# Altium schematic sheet DDS_OUT_channel.SchDoc: Output stage: Attenuator,
size 420 x 297 mm; Author: G.K.; CompanyName: WUT; DrawnBy: G.K.; Organization: WUT ISE; Address1: Warsaw Univeristy of Technology; Address2: Nowowiejska 15/19; DocumentNumber: 4; SheetNumber: 4; SheetTotal: 7; EDA_Number: ARTIQ; Projet: ARTIQ/SINARA; ModifiedBy: -; CreateDate: XX/XX/XXXX; CheckedDate: -; Title2: amplifier and filter; DivGrp: ISE; Designer: G.K.; ModifiedDate: -; ProjectName: ARTIQ/SINARA
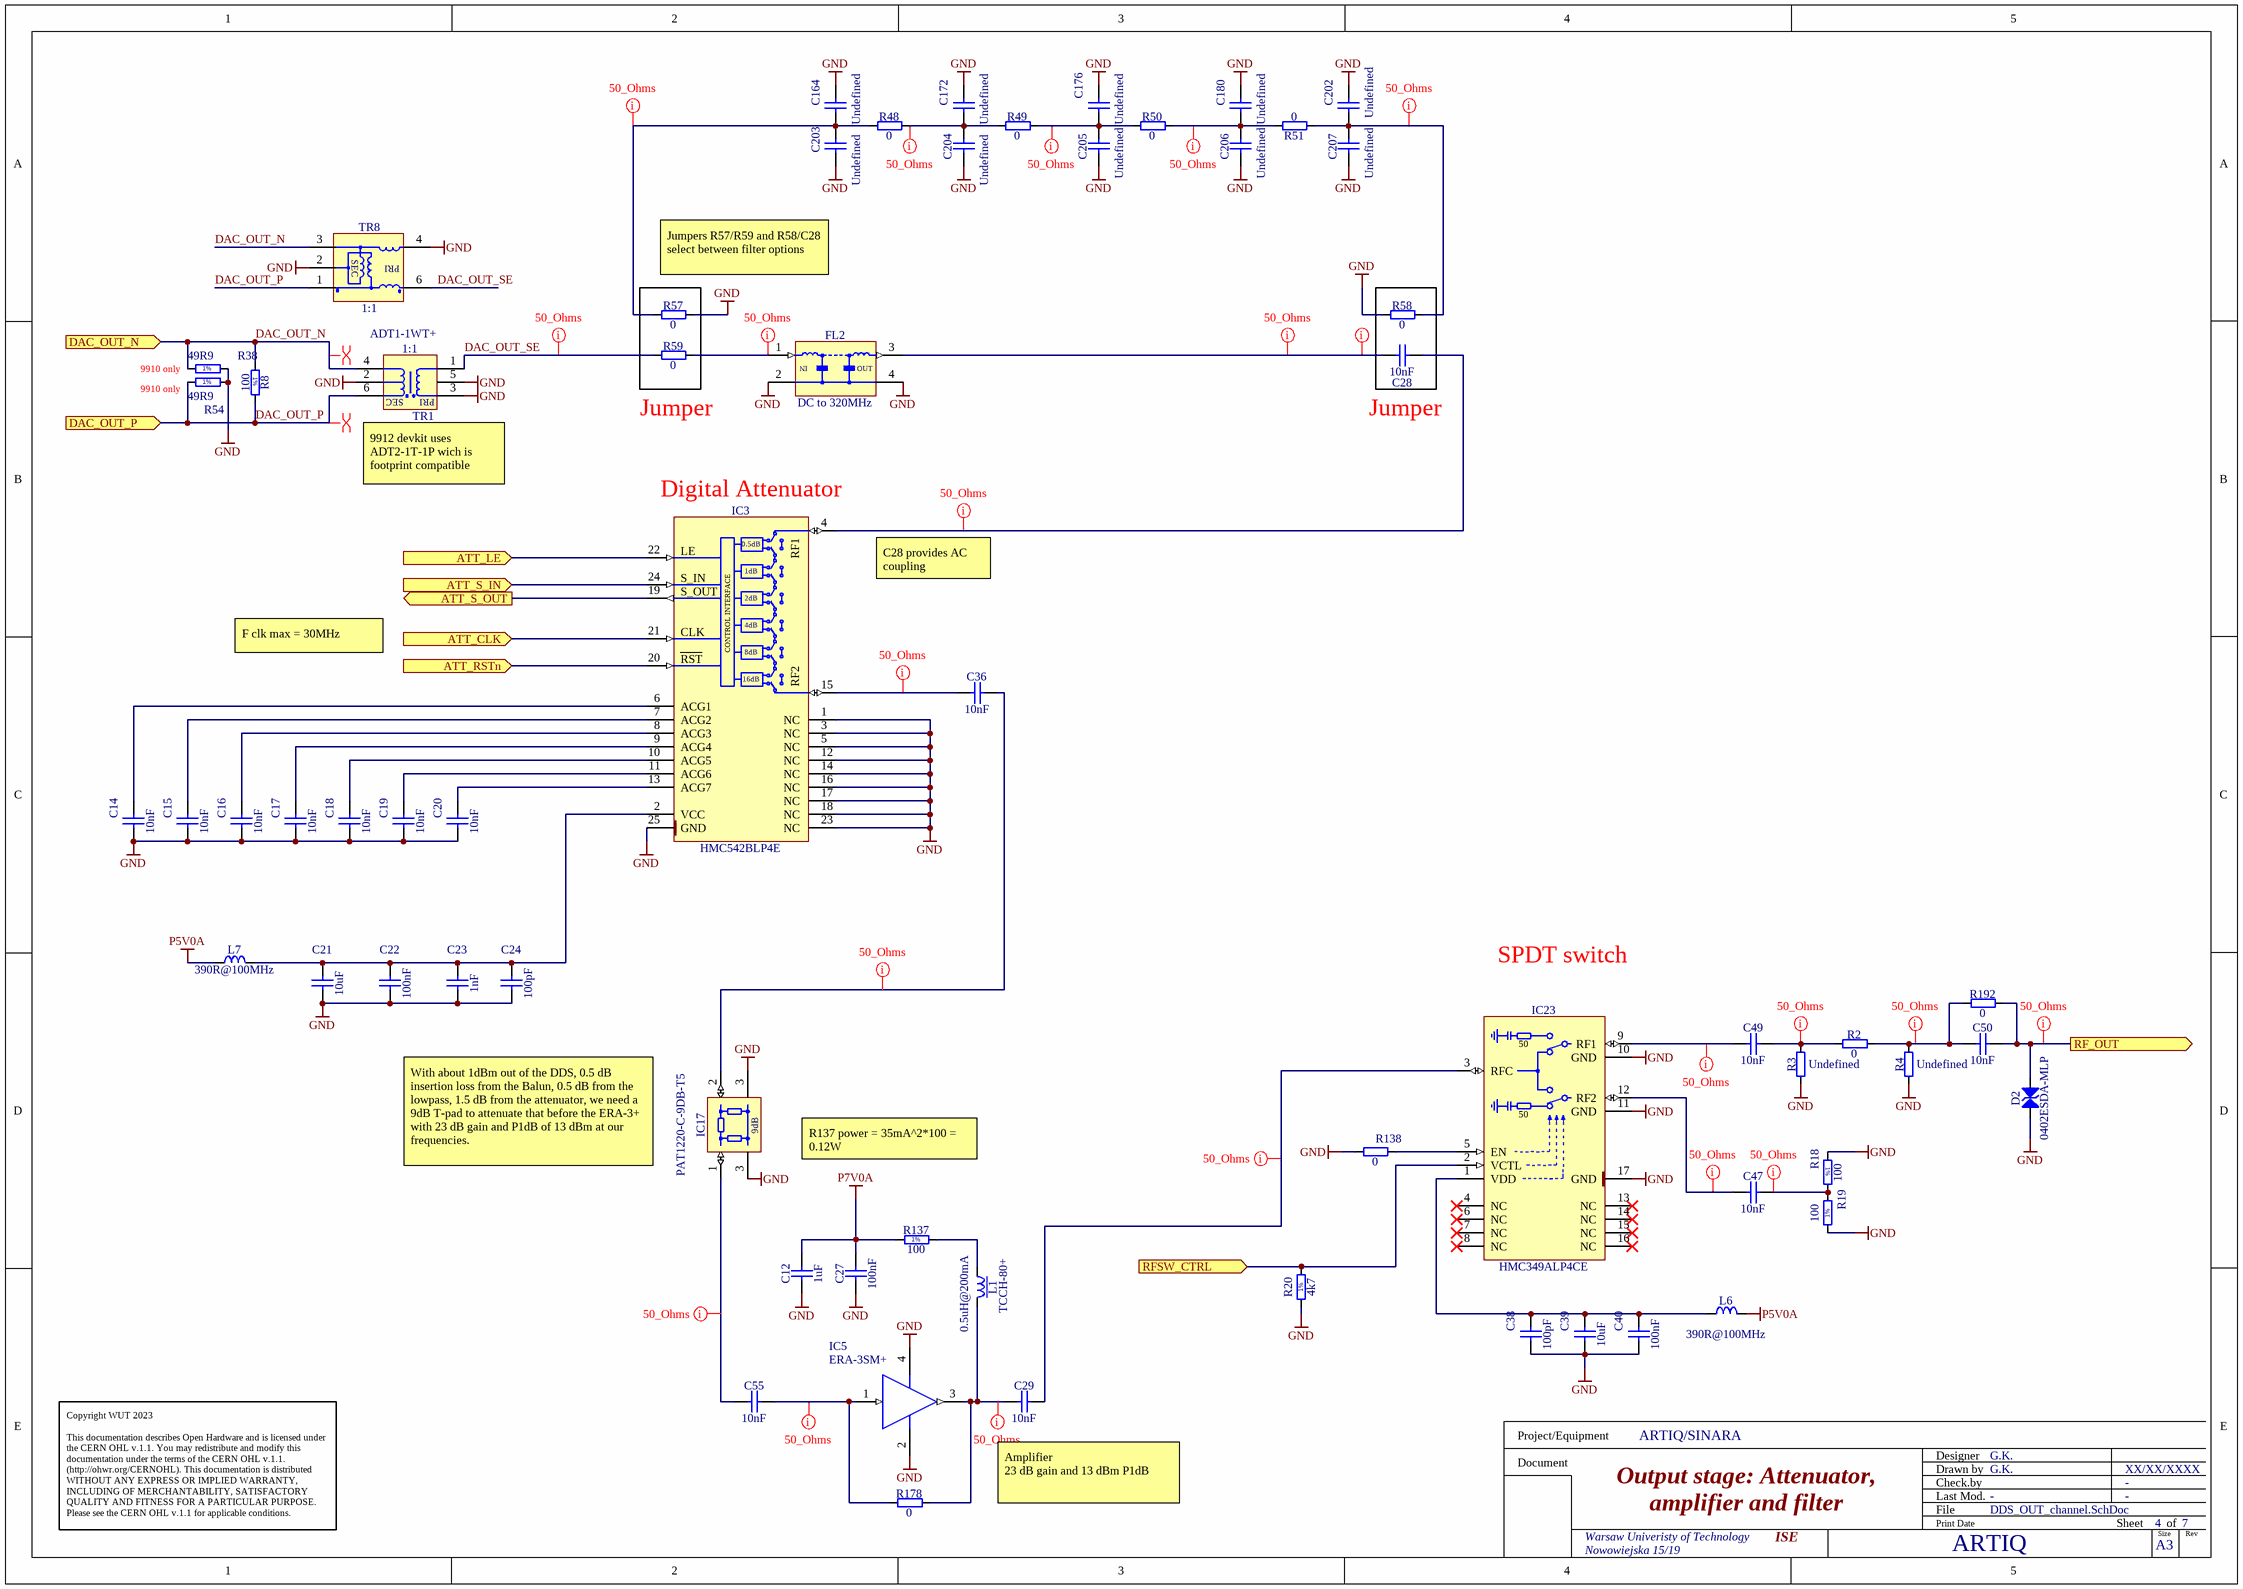
[diagram p0: DDS_OUT_channel.SchDoc]

## Parts
C12  1uF  [CAPC2012X140N]
C14  10nF  [CAPC1005X55N]
C15  10nF  [CAPC1005X55N]
C16  10nF  [CAPC1005X55N]
C17  10nF  [CAPC1005X55N]
C18  10nF  [CAPC1005X55N]
C19  10nF  [CAPC1005X55N]
C20  10nF  [CAPC1005X55N]
C21  10uF  [CAPC1608X80N]
C22  100nF  [CAPC1005X55N]
C23  1nF  [CAPC1005X55N]
C24  100pF  [CAPC1005X55N]
C27  100nF  [CAPC1005X55N]
C28  10nF  [CAPC1005X55N]
C29  10nF  [CAPC1005X55N]
C36  10nF  [CAPC1005X55N]
C38  100pF  [CAPC1005X55N]
C39  10uF  [CAPC1608X80N]
C40  100nF  [CAPC1005X55N]
C47  10nF  [CAPC1005X55N]
C49  10nF  [CAPC1005X55N]
C50  10nF  [CAPC1005X55N]
C55  10nF  [CAPC1005X55N]
C164  Undefined  [CAPC1005X55N]
C172  Undefined  [CAPC1005X55N]
C176  Undefined  [CAPC1005X55N]
C180  Undefined  [CAPC1005X55N]
C202  Undefined  [CAPC1005X55N]
C203  Undefined  [CAPC1005X55N]
C204  Undefined  [CAPC1005X55N]
C205  Undefined  [CAPC1005X55N]
C206  Undefined  [CAPC1005X55N]
C207  Undefined  [CAPC1005X55N]
D2  0402ESDA-MLP  [EATON_0402ESDA-MLP]
FL2  DC to 320MHz  [FIL_MINI-CIRCUITS_FV1206]
IC3  HMC542BLP4E  [QFN50P400X400X100-25N-S295]
IC5  ERA-3SM+  [MINI-CIRCUITS_WW107]
IC17  PAT1220-C-9DB-T5  [SUSUMU_PAT1220]
IC23  HMC349ALP4CE  [QFN65P400X400X100-17N-S255]
L1  0.5uH@200mA  Manufacturer Part Number: TCCH-80+  [IND_MINI-CIRCUITS_GU1604]
L6  390R@100MHz  [INDC1608X95N]
L7  390R@100MHz  [INDC1608X95N]
R2  0  [RESC1005X40N]
R3  Undefined  [RESC1005X40N]
R4  Undefined  [RESC1005X40N]
R8  100  [RESC1005X40N]
R18  100  [RESC1005X40N]
R19  100  [RESC1005X40N]
R20  4k7  [RESC1005X40N]
R38  49R9  [RESC1005X40N]
R48  0  [RESC1005X40N]
R49  0  [RESC1005X40N]
R50  0  [RESC1005X40N]
R51  0  [RESC1005X40N]
R54  49R9  [RESC1005X40N]
R57  0  [RESC1005X40N]
R58  0  [RESC1005X40N]
R59  0  [RESC1005X40N]
R137  100  [RESC3216X65N]
R138  0  [RESC1005X40N]
R178  0  [RESC1608X55N]
R192  0  [RESC1005X40N]
TR1  1:1  Manufacturer Part Number: ADT1-1WT+  [XFMR_MINI-CIRCUITS_CD542]
TR8  1:1  [XFMR_MINI-CIRCUITS_AT1521]

## Ports
ATT_CLK (in), ATT_LE (in), ATT_RSTn (in), ATT_S_IN (in), ATT_S_OUT (out), DAC_OUT_N (in), DAC_OUT_P (in), RF_OUT (out), RFSW_CTRL (in)

## Nets
GND: C12.1 C14.1 C15.1 C16.1 C17.1 C18.1 C19.1 C20.1 C21.1 C22.1 C23.1 C24.1 C27.1 C38.2 C39.1 C40.1 C164.2 C172.2 C176.2 C180.2 C202.2 C203.1 C204.1 C205.1 C206.1 C207.1 D2.1 FL2.2(GND) FL2.4(GND) IC3.1(NC) IC3.3(NC) IC3.5(NC) IC3.12(NC) IC3.14(NC) IC3.16(NC) IC3.17(NC) IC3.18(NC) IC3.23(NC) IC3.25(GND) IC5.2(GND) IC5.4(GND) IC17.3(GND) IC23.10(GND) IC23.11(GND) IC23.17(GND) R3.1 R4.1 R18.1 R19.1 R20.1 R38.2 R54.2 R57.2 R58.2 R138.1 TR1.2(SCT) TR1.3(PDOT) TR1.5(NC) TR8.2(SCT) TR8.4(P)
P5V0A: L6.2 L7.1
P7V0A: C12.2 C27.2 R137.1
ATT_CLK: IC3.21(SHIFT_CLOCK) ; port ATT_CLK
ATT_LE: IC3.22(LATCH_ENABLE) ; port ATT_LE
ATT_RSTn: IC3.20(~{RESET}) ; port ATT_RSTn
ATT_S_IN: IC3.24(SERIAL_INPUT) ; port ATT_S_IN
ATT_S_OUT: IC3.19(SERIAL_OUTPUT) ; port ATT_S_OUT
DAC_OUT_N: R8.1 R38.1 TR1.4(S) TR8.3(S) ; port DAC_OUT_N
DAC_OUT_P: R8.2 R54.1 TR1.6(SDOT) TR8.1(SDOT) ; port DAC_OUT_P
DAC_OUT_SE: R59.1 TR1.1(P) TR8.6(PDOT)
RF_OUT: C50.2 D2.2 R192.2 ; port RF_OUT
RFSW_CTRL: IC23.2(VCTL) R20.2 ; port RFSW_CTRL
NetC14_2: C14.2 IC3.6(ACG1)
NetC15_2: C15.2 IC3.7(ACG2)
NetC16_2: C16.2 IC3.8(ACG3)
NetC17_2: C17.2 IC3.9(ACG4)
NetC18_2: C18.2 IC3.10(ACG5)
NetC19_2: C19.2 IC3.11(ACG6)
NetC20_2: C20.2 IC3.13(ACG7)
NetC21_2: C21.2 C22.2 C23.2 C24.2 IC3.2(VCC) L7.2
NetC28_1: C28.1 FL2.3(RFOUT)
NetC28_2: C28.2 IC3.4(RF1)
NetC29_1: C29.1 IC5.3(RF_OUT) L1.3 R178.2
NetC29_2: C29.2 IC23.3(RFC)
NetC36_1: C36.1 IC3.15(RF2)
NetC36_2: C36.2 IC17.2(OUT)
NetC38_1: C38.1 C39.2 C40.2 IC23.1(VDD) L6.1
NetC47_1: C47.1 IC23.12(RF2)
NetC47_2: C47.2 R18.2 R19.2
NetC49_1: C49.1 IC23.9(RF1)
NetC49_2: C49.2 R2.1 R3.2
NetC50_1: C50.1 R2.2 R4.2 R192.1
NetC55_1: C55.1 IC17.1(IN)
NetC55_2: C55.2 IC5.1(RF_IN) R178.1
NetC164_1: C164.1 C203.2 R48.1 R57.1
NetC172_1: C172.1 C204.2 R48.2 R49.1
NetC176_1: C176.1 C205.2 R49.2 R50.1
NetC180_1: C180.1 C206.2 R50.2 R51.2
NetC202_1: C202.1 C207.2 R51.1 R58.1
NetFL2_1: FL2.1(RFIN) R59.2
NetIC23_5: IC23.5(EN) R138.2
NetL1_1: L1.1 R137.2

Not connected (* = marked no-connect by the designer): IC23 4(NC)* 6(NC)* 7(NC)* 8(NC)* 13(NC)* 14(NC)* 15(NC)* 16(NC)*

## Layout directives
net class 50_Ohms: DAC_OUT_SE, NetC28_1, NetC28_2, NetC29_1, NetC29_2, NetC36_1, NetC36_2, NetC47_1, NetC47_2, NetC49_1, NetC49_2, NetC50_1, NetC55_1, NetC55_2, NetC164_1, NetC172_1, NetC176_1, NetC180_1, NetC202_1, NetFL2_1, RF_OUT
differential pair: DAC_OUT_N, DAC_OUT_P

## Notes on the sheet
- (near R57) Jumpers R57/R59 and R58/C28 select between filter options
- 9910 only
- (near R59) Jumper
- (near C28) Jumper
- (near TR1) 9912 devkit uses ADT2-1T-1P wich is footprint compatible
- (near IC3) Digital Attenuator
- C28 provides AC coupling
- F clk max = 30MHz
- SPDT switch
- With about 1dBm out of the DDS, 0.5 dB insertion loss from the Balun, 0.5 dB from the lowpass, 1.5 dB from the attenuator, we need a 9dB T-pad to attenuate that before the ERA-3+ with 23 dB gain and P1dB of 13 dBm at our frequencies.
- R137 power = 35mA^2*100 = 0.12W
- Copyright WUT 2023
  This documentation describes Open Hardware and is licensed under the CERN OHL v.1.1. You may redistribute and modify this documentation under the terms of the CERN OHL v.1.1. (http://ohwr.org/CERNOHL). This documentation is distributed WITHOUT ANY EXPRESS OR IMPLIED WARRANTY, INCLUDING OF MERCHANTABILITY, SATISFACTORY QUALITY AND FITNESS FOR A PARTICULAR PURPOSE. Please see the CERN OHL v.1.1 for applicable conditions.
- Amplifier
  23 dB gain and 13 dBm P1dB
- Project/Equipment
- Document
- Designer
- Drawn by
- Check.by
- File
- Last Mod.
- Print Date
- Sheet
- Size
- A3
- of
- Rev
- (in symbol FIL_MINI-CIRCUITS_LFCN-320) IN; OUT
- (in symbol HMC349ALP4CE) 50
- (in symbol HMC542BLP4E) 0.5dB; LE; 1dB; S_IN; S_OUT; 2dB; CONTROL INTERFACE; 4dB; CLK; 8dB; RST; 16dB
- (in symbol R0402_4K7_1%_0.0625W_100PPM) 1%
- (in symbol R0402_49R9_1%_0.0625W_100PPM) 1%
- (in symbol R0402_100R_1%_0.0625W_100PPM) 1%
- (in symbol R1206_100R_1%_0.5W_100PPM_VISHAY_CRCW-HP e3) 1%
- (in symbol RF_PAT1220-C-9DB-T5) 9dB
- (in symbol XFMR_MINI-CIRCUITS_ADT1-1WT+) SEC; PRI
- (in symbol XFMR_MINI-CIRCUITS_TC1-1T-152X+) SEC; PRI

## Library data of the parts
C12 = CC0805_1UF_35V_20%_X7R: Non-polarised capacitor; Part Description: SMD Multilayer Chip Ceramic Capacitor; Manufacturer: GENERIC; Manufacturer1 Part Number: GMK212B7105MG-T; Voltage: 35V; TC: X7R; Tolerance: ±20%; Part Number: CC0805_1UF_35V_20%_X7R; Component Kind: Standard; Component Type: Standard; Pin Count: 2; Value: 1uF; Status: Not Recommended; Manufacturer Part Number: CC0805_1UF_35V_20%_X7R; Case: 0805; Mounted: Yes; Socket: No; SMD: Yes; Sense: No; Manufacturer1 Example: TAIYO YUDEN; Manufacturer1 ComponentHeight: 1.35mm; HelpURL: \\cern.ch\dfs\Applications\Altium\Datasheets\CC0805_X7R_TAIYO-YUDEN_HIGH-VALUE.pdf; Author: CERN DEM JLC; CreateDate: 2011-06-22; LatestRevisionDate: 2011-06-22
C14-C20 C28 C29 C36 C47 C49 C50 C55 = CC0402_10NF_16V_10%_X7R: Non-polarised capacitor; Part Description: SMD Multilayer Chip Ceramic Capacitor; Manufacturer: GENERIC; Manufacturer1 Part Number: 223878715636; Voltage: 16V; TC: X7R; Tolerance: ±10%; Part Number: CC0402_10NF_16V_10%_X7R; Component Kind: Standard; Component Type: Standard; Pin Count: 2; Value: 10nF; Status: Not Recommended; Manufacturer Part Number: CC0402_10NF_16V_10%_X7R; Case: 0402; Mounted: Yes; Socket: No; SMD: Yes; Sense: No; Manufacturer1 Example: PHYCOMP; Manufacturer1 ComponentHeight: 0.55mm; HelpURL: \\cern.ch\dfs\Applications\Altium\Datasheets\CC0402_X7R_PHYCOMP.pdf; Author: CERN DEM JLC; CreateDate: 2007-12-03; LatestRevisionDate: 2007-12-03
C21 C39 = CC0603_10UF_16V_20%_X5R: Non-polarised capacitor; Part Description: SMD Multilayer Chip Ceramic Capacitor; Manufacturer: GENERIC; Manufacturer1 Part Number: GRM188R61C106MA73D; Voltage: 16V; TC: X5R; Tolerance: ±20%; Part Number: CC0603_10UF_16V_20%_X5R; Component Kind: Standard; Component Type: Standard; Pin Count: 2; Value: 10uF; Status: None; Manufacturer Part Number: CC0603_10UF_16V_20%_X5R; Case: 0603; Mounted: Yes; Socket: No; SMD: Yes; Sense: No; Manufacturer1 Example: MURATA; Manufacturer1 ComponentHeight: 0.8mm; HelpURL: \\cern.ch\dfs\Applications\Altium\Datasheets\CC0603_X5R_MURATA_GRM.pdf; Author: CERN DEM MR; CreateDate: 2016-03-02; LatestRevisionDate: 2016-03-02
C22 = CC0402_100NF_16V_10%_X7R: Non-polarised capacitor; Part Description: SMD Multilayer Chip Ceramic Capacitor; Manufacturer: GENERIC; Manufacturer1 Part Number: GRM155R71C104KA88D; Voltage: 16V; TC: X7R; Tolerance: ±10%; Part Number: CC0402_100NF_16V_10%_X7R; Component Kind: Standard; Component Type: Standard; Pin Count: 2; Value: 100nF; Status: Not Recommended; Manufacturer Part Number: CC0402_100NF_16V_10%_X7R; Case: 0402; Mounted: Yes; Socket: No; SMD: Yes; Sense: No; Manufacturer1 Example: MURATA; Manufacturer1 ComponentHeight: 0.55mm; HelpURL: \\cern.ch\dfs\Applications\Altium\Datasheets\CC0402_X7R_MURATA_GRM.pdf; Author: CERN DEM JLC; CreateDate: 2013-12-05; LatestRevisionDate: 2007-12-03
C23 = CC0402_1NF_50V_10%_X7R: Non-polarised capacitor; Part Description: SMD Multilayer Chip Ceramic Capacitor; Manufacturer: GENERIC; Manufacturer1 Part Number: 223858715623; Voltage: 50V; TC: X7R; Tolerance: ±10%; Part Number: CC0402_1NF_50V_10%_X7R; Component Kind: Standard; Component Type: Standard; Pin Count: 2; Value: 1nF; Status: Not Recommended; Manufacturer Part Number: CC0402_1NF_50V_10%_X7R; Case: 0402; Mounted: Yes; Socket: No; SMD: Yes; Sense: No; Manufacturer1 Example: PHYCOMP; Manufacturer1 ComponentHeight: 0.55mm; HelpURL: \\cern.ch\dfs\Applications\Altium\Datasheets\CC0402_X7R_PHYCOMP.pdf; Author: CERN DEM JLC; CreateDate: 2007-12-03; LatestRevisionDate: 2007-12-03
C24 C38 = CC0402_100PF_50V_5%_C0G: Non-polarised capacitor; Part Description: SMD Multilayer Chip Ceramic Capacitor; Manufacturer: GENERIC; Manufacturer1 Part Number: C0402C101J5GACTU; Voltage: 50V; TC: C0G/NP0; Tolerance: ±5%; Part Number: CC0402_100PF_50V_5%_C0G; Component Kind: Standard; Component Type: Standard; Pin Count: 2; Value: 100pF; Status: Preferred; Manufacturer Part Number: CC0402_100PF_50V_5%_C0G; Case: 0402; Mounted: Yes; Socket: No; SMD: Yes; Sense: No; Manufacturer1 Example: KEMET; Manufacturer1 ComponentHeight: 0.55mm; HelpURL: \\cern.ch\dfs\Applications\Altium\Datasheets\CC0805_C0G_KEMET_(Commercial Grade).pdf; Author: CERN DEM JLC; CreateDate: 2007-12-03; LatestRevisionDate: 2015-04-22
C27 C40 = CC0402_100NF_16V_10%_X5R: Non-polarised capacitor; Part Description: SMD Multilayer Chip Ceramic Capacitor; Manufacturer: GENERIC; Manufacturer1 Part Number: GRM155R61C104KA88D; Voltage: 16V; TC: X5R; Tolerance: ±10%; Part Number: CC0402_100NF_16V_10%_X5R; Component Kind: Standard; Component Type: Standard; Pin Count: 2; Value: 100nF; Status: None; Manufacturer Part Number: CC0402_100NF_16V_10%_X5R; Case: 0402; Mounted: Yes; Socket: No; SMD: Yes; Sense: No; Manufacturer1 Example: MURATA; Manufacturer1 ComponentHeight: 0.55mm; HelpURL: \\cern.ch\dfs\Applications\Altium\Datasheets\CC0402_X5R_MURATA_GRM.pdf; Author: CERN DEM JLC; CreateDate: 10.12.2013; LatestRevisionDate: 10.12.2013
C164 C172 C176 C180 C202-C207 = CC0402_NO-VALUE: Non-polarised capacitor; Part Description: Reserved Footprint For 0402(1005) Chip Ceramic Capacitor; Mounted: No; Part Number: CC0402_NO-VALUE; Component Kind: Standard; Component Type: Standard; Pin Count: 2; Value: Undefined; Status: None; Manufacturer: Undefined; Manufacturer Part Number: CC0402_NO-VALUE; Case: 0402; Socket: No; SMD: Yes; Sense: No; Manufacturer1 ComponentHeight: 0.55mm; HelpURL: Undefined; Author: CERN DEM JLC; CreateDate: 14.01.2014; LatestRevisionDate: 14.01.2014
D2 = 0402ESDA-MLP: Transient Voltage Suppressor Diode (Bi-Directional); Part Description: 0.05pF 8kV Bidirectional ESD Voltage Suppressor; Manufacturer: EATON; Voltage: 8kV; PressFit: No; Bonding: No; Part Number: 0402ESDA-MLP; Component Kind: Standard; Component Type: Standard; Device: 0402ESDA-MLP; PackageDescription: 0402, 2-Leads, Body 1.1mm L X 0.53mm W X 0.44mm H body, IPC Medium Density; Manufacturer Part Number: 0402ESDA-MLP; Pin Count: 2; Case: 0402; Mounted: Yes; Socket: No; SMD: Yes; Sense: No; ComponentHeight: 0.44mm; HelpURL: \\cern.ch\dfs\Applications\Altium\Datasheets\0402ESDA-MLP.pdf; Author: CERN DEM MR; CreateDate: 22.11.2019; LatestRevisionDate: 22.11.2019
FL2 = FIL_MINI-CIRCUITS_LFCN-320: 50 Ohm DC to 320MHz Low Pass Filter; Part Description: 50 Ohm Low Pass Filter; Part Number: FIL_MINI-CIRCUITS_LFCN-320; Component Kind: Standard; Component Type: Standard; Pin Count: 2; Value: DC to 320MHz; Status: None; Manufacturer: MINI-CIRCUITS; Manufacturer Part Number: LFCN-320; Mounted: Yes; Socket: No; SMD: Yes; Sense: No; ComponentHeight: 0.94mm; HelpURL: \\cern.ch\dfs\Applications\Altium\Datasheets\FIL_MINI-CIRCUITS_LFCN-3000+.pdf; Author: CERN DEM JLC; CreateDate: 2013-12-09; LatestRevisionDate: 2013-12-09
IC3 = HMC542BLP4E: 0.5dB LSB GaAs MMIC 6-bit Digital Serial Control Attenuator, DC - 4GHz; Part Description: 0.5dB LSB GaAs MMIC 6-bit Digital Serial Control Attenuator, DC to 4GHz; Manufacturer: HITTITE MICROWAVE CORP; PressFit: No; Bonding: No; Part Number: HMC542BLP4E; Component Kind: Standard; Component Type: Standard; Device: HMC542BLP4E; PackageDescription: QFN, 0.50mm Pitch, Square; 24 Pin, 4.00mm L X 4.00mm W X 1.00mm H Body (w/thermal Tab 2.95 X 2.95mm), IPC Medium Density; Manufacturer Part Number: HMC542BLP4E; Pin Count: 25; Case: QFN24; Mounted: Yes; Socket: No; SMD: Yes; Sense: No; ComponentHeight: 1mm; Author: CERN DEM JMW; HelpURL: \\cern.ch\dfs\Applications\Altium\Datasheets\HMC542BLP4E.pdf; CreateDate: 2016-08-17; LatestRevisionDate: 2016-08-17
IC5 = RF_ERA-3SM+: DC-3GHz Monolithic Amplifier; Manufacturer: MINI-CIRCUITS; PressFit: No; Bonding: No; Part Number: ERA-3SM+; Component Kind: Standard; Component Type: Standard; Device: ERA-3SM+; PackageDescription: MINI-CIRCUITS WW107 Case, Body 2.16mm Diameter X 1.52mm H; Part Description: DC-3GHz Monolithic Amplifier; Manufacturer Part Number: ERA-3SM+; Pin Count: 4; Mounted: Yes; Socket: No; SMD: Yes; Sense: No; ComponentHeight: 1.52mm; Author: GK; HelpURL: \\cern.ch\dfs\Applications\Altium\Datasheets\ERA-4XSM+.pdf; CreateDate: 11.08.2016; LatestRevisionDate: 11.08.2016
IC17 = RF_PAT1220-C-9DB-T5: DC to 10GHz, 100mw, 50 Ohm, 9dB, Precision chip attenuator; Part Description: DC to 10GHz, 100mw, 50 Ohm, 9dB, Precision Chip 3dB Attenuator; Manufacturer: SUSUMU; PressFit: No; Sense Comment: Solder Paste Deposition Limitation; Bonding: No; Part Number: PAT1220-C-9DB-T5; Component Kind: Standard; Component Type: Standard; Device: PAT1220-C-9DB-T5; Footprint: SUSUMU_PAT1220-C-9DB-T5; PackageDescription: SUSUMU PAT1220, 4 Pin Attenuator, Sise 0402, L 1.00 x W 0.5 H 0.39mm; Status: Recommended; Manufacturer Part Number: PAT1220-C-9DB-T5; Pin Count: 4; Case: 0402; Mounted: Yes; Socket: No; SMD: Yes; Sense: Yes; ComponentHeight: 0.39mm; Author: GK; HelpURL: \\cern.ch\dfs\Applications\Altium\Datasheets\PAT0510S-C-9DB-T10.pdf; CreateDate: 09.03.2017; LatestRevisionDate: 02.05.2017
IC23 = HMC349ALP4CE: DC-4GHz High Isolation SPDT Non-Reflective Switch; Manufacturer: ANALOG DEVICES; PressFit: No; Bonding: No; Part Number: HMC349ALP4CE; Component Kind: Standard; Component Type: Standard; Device: HMC349ALP4CE; PackageDescription: QFN, 0.65mm pitch,square; 4 pin X 4 pin, 4mm X 4mm X 1mm H body (w/thermal tab 2.55 X 2.55mm),  IPC Medium Density; Part Description: DC-4GHz High Isolation SPDT Non-Reflective Switch; Manufacturer Part Number: HMC349ALP4CE; Pin Count: 17; Case: QFN16; Mounted: Yes; Socket: No; SMD: Yes; Sense: No; ComponentHeight: 1mm; Author: CERN DEM JLC; HelpURL: \\cern.ch\dfs\Applications\Altium\Datasheets\HMC349ALP4CE.pdf; CreateDate: 23.02.2017; LatestRevisionDate: 23.02.2017
L1 = IND_MINI-CIRCUITS_TCCH-80+: 50 Ohms, 50 to 8200 MHz RF Choke; Power: 200mA; Resistance: 0.1R; Part Number: IND_MINI-CIRCUITS_TCCH-80+; Component Kind: Standard; Component Type: Standard; Pin Count: 4; Value: 0.5uH@200mA; Status: None; Part Description: 50 Ohms, 50 to 8200 MHz RF Choke; Manufacturer: MINI-CIRCUITS; Mounted: Yes; Socket: No; SMD: Yes; Sense: No; ComponentHeight: 3.81mm; HelpURL: \\cern.ch\dfs\Applications\Altium\Datasheets\IND_MINI-CIRCUITS_TCCH-80+.pdf; Author: CERN DEM JLC; CreateDate: 2011-12-19; LatestRevisionDate: 2011-12-19
L6 L7 = IND0603_TDK_MPZ1608R391A: Inductor; Part Description: SMT Chip Bead for Power Line; Manufacturer: TDK; Power: 1.2A; Resistance: 0.12R; Tolerance: ±25%; Part Number: IND0603_TDK_MPZ1608R391A; Component Kind: Standard; Component Type: Standard; Pin Count: 2; Value: 390R@100MHz; Status: None; Manufacturer Part Number: MPZ1608R391A; Case: 0603; Mounted: Yes; Socket: No; SMD: Yes; Sense: No; ComponentHeight: 0.95mm; HelpURL: \\cern.ch\dfs\Applications\Altium\Datasheets\IND0603_TDK_MPZ1608.pdf; Author: CERN DEM JLC; CreateDate: 2009-12-02; LatestRevisionDate: 2009-12-02
R2 R48-R51 R57-R59 R138 R192 = R0402_0R_JUMPER: Resistor; Part Description: 1A (0.05R Max DC Resistance) Zero Ohm Jumper; Manufacturer: GENERIC; Manufacturer1 Part Number: 232270591001L; Part Number: R0402_0R_JUMPER; Component Kind: Standard; Component Type: Standard; Pin Count: 2; Value: 0; Status: Not recommended; Manufacturer Part Number: R0402_0R_JUMPER; Case: 0402; Mounted: Yes; Sense: No; Socket: No; SMD: Yes; Manufacturer1 Example: YAGEO PHYCOMP; Manufacturer1 ComponentHeight: 0.4mm; HelpURL: \\cern.ch\dfs\Applications\Altium\Datasheets\R0402_Phycomp_RC0402.pdf; Author: CERN DEM JLC; CreateDate: 2007-12-03; LatestRevisionDate: 2012-10-17
R3 R4 = R0402_NO-VALUE: Resistor; Part Description: Reserved Footprint For a 0402 (1005) Chip Resistor; Mounted: No; Part Number: R0402_NO-VALUE; Component Kind: Standard; Component Type: Standard; Pin Count: 2; Value: Undefined; Status: None; Manufacturer: Undefined; Manufacturer Part Number: R0402_NO-VALUE; Case: 0402; Sense: No; Socket: No; SMD: Yes; Manufacturer1 Example: Undefined; Manufacturer1 Part Number: Undefined; Manufacturer1 ComponentHeight: Undefined; HelpURL: Undefined; Author: CERN DEM JLC; CreateDate: 03.12.2007; LatestRevisionDate: 13.03.2008
R8 R18 R19 = R0402_100R_1%_0.0625W_100PPM: Resistor - 1%; Part Description: General Purpose Thick Film Chip Resistor; Manufacturer: GENERIC; Manufacturer1 Part Number: 232270671001L; TC: ±100ppm/°C; PressFit: No; Part Number: R0402_100R_1%_0.0625W_100PPM; Component Kind: Standard; Component Type: Standard; Pin Count: 2; Value: 100; Status: Not Recommended; Power: 0.0625W; Tolerance: ±1%; Manufacturer Part Number: R0402_100R_1%_0.0625W_100PPM; Case: 0402; Mounted: Yes; Sense: No; Socket: No; SMD: Yes; Manufacturer1 Example: YAGEO PHYCOMP; Manufacturer1 ComponentHeight: 0.4mm; HelpURL: \\cern.ch\dfs\Applications\Altium\Datasheets\R0402_Phycomp_RC0402.pdf; Author: CERN DEM JLC; CreateDate: 03.12.2007; LatestRevisionDate: 17.10.2012
R20 = R0402_4K7_1%_0.0625W_100PPM: Resistor - 1%; Part Description: General Purpose Thick Film Chip Resistor; Manufacturer: GENERIC; Manufacturer1 Part Number: 232270674702L; TC: ±100ppm/°C; Part Number: R0402_4K7_1%_0.0625W_100PPM; Component Kind: Standard; Component Type: Standard; Pin Count: 2; Value: 4k7; Status: Not recommended; Power: 0.0625W; Tolerance: ±1%; Manufacturer Part Number: R0402_4K7_1%_0.0625W_100PPM; Case: 0402; Mounted: Yes; Sense: No; Socket: No; SMD: Yes; Manufacturer1 Example: YAGEO PHYCOMP; Manufacturer1 ComponentHeight: 0.4mm; HelpURL: \\cern.ch\dfs\Applications\Altium\Datasheets\R0402_Phycomp_RC0402.pdf; Author: CERN DEM JLC; CreateDate: 2007-12-03; LatestRevisionDate: 2012-10-17
R38 R54 = R0402_49R9_1%_0.0625W_100PPM: Resistor - 1%; Part Description: General Purpose Thick Film Chip Resistor; Manufacturer: GENERIC; Manufacturer1 Part Number: 232270674999L or RC0402FR-0749R9L; TC: ±100ppm/°C; PressFit: No; Part Number: R0402_49R9_1%_0.0625W_100PPM; Component Kind: Standard; Component Type: Standard; Pin Count: 2; Value: 49R9; Status: Not Recommended; Power: 0.0625W; Tolerance: ±1%; Manufacturer Part Number: R0402_49R9_1%_0.0625W_100PPM; Case: 0402; Mounted: Yes; Sense: No; Socket: No; SMD: Yes; Manufacturer1 Example: YAGEO PHYCOMP; Manufacturer1 ComponentHeight: 0.4mm; HelpURL: \\cern.ch\dfs\Applications\Altium\Datasheets\R0402_Phycomp_RC0402.pdf; Author: CERN DEM JLC; CreateDate: 24.10.2012; LatestRevisionDate: 24.10.2012
R137 = R1206_100R_1%_0.5W_100PPM_VISHAY_CRCW-HP e3: Resistor - 1%; Part Description: Pulse Proof, High Power Thick Film Chip Resistor; Manufacturer: VISHAY DRALORIC; Manufacturer Part Number: CRCW1206100RFKEAHP; Power: 0.5W; TC: ±100ppm/°C; Voltage: 200V; PressFit: No; Part Number: R1206_100R_1%_0.5W_100PPM_VISHAY_CRCW-HP e3; Component Kind: Standard; Component Type: Standard; Pin Count: 2; Value: 100; Status: None; Tolerance: ±1%; Case: 1206; Mounted: Yes; Sense: No; Socket: No; SMD: Yes; HelpURL: \\cern.ch\dfs\Applications\Altium\Datasheets\R1206_VISHAY_CRCW-HP e3.pdf; Author: CERN DEM JLC; CreateDate: 19.11.2013; LatestRevisionDate: 19.11.2013; ComponentHeight: 0.65mm
R178 = R0603_0R_JUMPER: Resistor; Part Description: 1A (0.05R Max DC Resistance) Zero Ohm Jumper; Manufacturer: GENERIC; Manufacturer1 Part Number: NRC06Z0; PressFit: No; Part Number: R0603_0R_JUMPER; Component Kind: Standard; Component Type: Standard; Pin Count: 2; Value: 0; Status: Preferred; Manufacturer Part Number: R0603_0R_JUMPER; Case: 0603; Mounted: Yes; Sense: No; Socket: No; SMD: Yes; Manufacturer1 Example: NIC COMPONENT; Manufacturer1 ComponentHeight: 0.55mm; HelpURL: \\cern.ch\dfs\Applications\Altium\Datasheets\R0603_NIC_NRC.pdf; Author: CERN DEM JLC; CreateDate: 03/12/2007; LatestRevisionDate: 13/03/2008
TR1 = XFMR_MINI-CIRCUITS_ADT1-1WT+: 75 Ohm 0.4 To 800MHz RF Transformers; Part Description: 75 Ohms 0.4 to 800 MHz RF Transformer; Part Number: XFMR_MINI-CIRCUITS_ADT1-1WT+; Component Kind: Standard; Component Type: Standard; Pin Count: 6; Value: 1:1; Status: None; Manufacturer: MINI-CIRCUITS; Mounted: Yes; Socket: No; Sense: No; SMD: Yes; ComponentHeight: 2.84mm; HelpURL: \\cern.ch\dfs\Applications\Altium\Datasheets\XFMR_MINI-CIRCUITS_ADT1-1WT+.pdf; Author: CERN DEM JLC; CreateDate: 21.09.2011; LatestRevisionDate: 21.09.2011
TR8 = XFMR_MINI-CIRCUITS_TC1-1T-152X+: 50 Ohms 5 To 1500MHz TLT RF Transformer; Part Number: XFMR_MINI-CIRCUITS_TC1-1T-152X+; Component Kind: Standard; Component Type: Standard; Pin Count: 5; Value: 1:1; Status: None; Part Description: 50 Ohms 5 To 1500MHz TLT RF Transformer; Manufacturer: MINI-CIRCUITS; Manufacturer Part Number: TC1-1T-152X+; Mounted: Yes; Socket: No; Sense: No; SMD: Yes; ComponentHeight: 4.06mm; HelpURL: \\cern.ch\dfs\Applications\Altium\Datasheets\XFMR_MINI-CIRCUITS_TC1-1-43X+.pdf; Author: GK; CreateDate: 10.08.2016; LatestRevisionDate: 10.08.2016